# Altium schematic sheet 05_IO.SchDoc
size A4; CheckedBy: Inženjer 2; CompanyName: Byte Lab Grupa d.o.o.; Engineer: Matija Puskar; Organization: Byte Lab Grupa d.o.o.; Address1: Medarska 69/1, 10000 Zagreb, Croatia; DocumentNumber: 1; SheetNumber: 5; SheetTotal: 7; Web: www.byte-lab.com; ProjectName: P1X-0XX
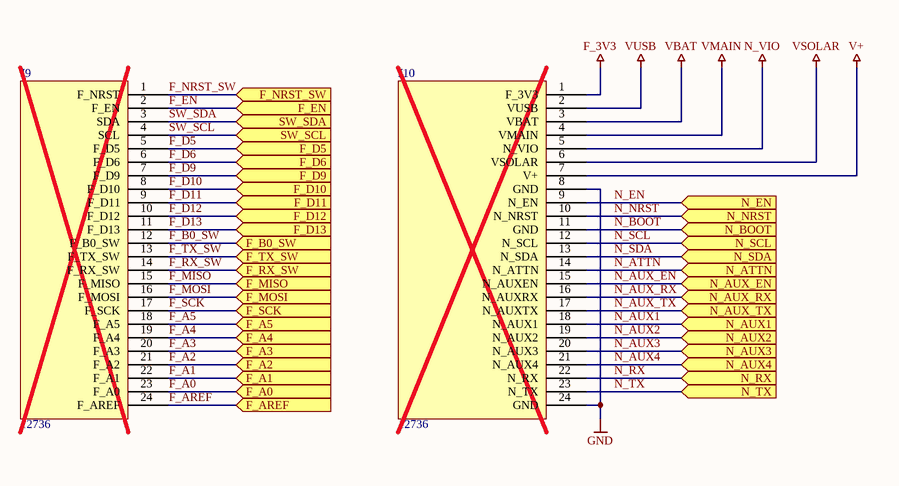
[diagram p0: 05_IO.SchDoc]

## Parts
J9  12736  [CES-124-01-S-S]
J10  12736  [CES-124-01-S-S]

## Ports
F_A0 (in), F_A1 (in), F_A2 (in), F_A3 (in), F_A4 (in), F_A5 (in), F_AREF (in), F_B0_SW (in), F_D5 (in), F_D6 (in), F_D9 (in), F_D10 (in), F_D11 (in), F_D12 (in), F_D13 (in), F_EN (in), F_MISO (in), F_MOSI (in), F_NRST_SW (in), F_RX_SW (in), F_SCK (in), F_TX_SW (in), N_ATTN (in), N_AUX1 (in), N_AUX2 (in), N_AUX3 (in), N_AUX4 (in), N_AUX_EN (in), N_AUX_RX (in), N_AUX_TX (in), N_BOOT (in), N_EN (in), N_NRST (in), N_RX (in), N_SCL (in), N_SDA (in), N_TX (in), SW_SCL (in), SW_SDA (in)

## Nets
F_3V3: J10.1(F_3V3)
GND: J10.8(GND) J10.24(GND)
N_VIO: J10.5(N_VIO)
V+: J10.7(V+)
VBAT: J10.3(VBAT)
VMAIN: J10.4(VMAIN)
VSOLAR: J10.6(VSOLAR)
VUSB: J10.2(VUSB)
F_A0: J9.23(F_A0) ; port F_A0
F_A1: J9.22(F_A1) ; port F_A1
F_A2: J9.21(F_A2) ; port F_A2
F_A3: J9.20(F_A3) ; port F_A3
F_A4: J9.19(F_A4) ; port F_A4
F_A5: J9.18(F_A5) ; port F_A5
F_AREF: J9.24(F_AREF) ; port F_AREF
F_B0_SW: J9.12(F_B0_SW) ; port F_B0_SW
F_D5: J9.5(F_D5) ; port F_D5
F_D6: J9.6(F_D6) ; port F_D6
F_D9: J9.7(F_D9) ; port F_D9
F_D10: J9.8(F_D10) ; port F_D10
F_D11: J9.9(F_D11) ; port F_D11
F_D12: J9.10(F_D12) ; port F_D12
F_D13: J9.11(F_D13) ; port F_D13
F_EN: J9.2(F_EN) ; port F_EN
F_MISO: J9.15(F_MISO) ; port F_MISO
F_MOSI: J9.16(F_MOSI) ; port F_MOSI
F_NRST_SW: J9.1(F_NRST) ; port F_NRST_SW
F_RX_SW: J9.14(F_RX_SW) ; port F_RX_SW
F_SCK: J9.17(F_SCK) ; port F_SCK
F_TX_SW: J9.13(F_TX_SW) ; port F_TX_SW
N_ATTN: J10.14(N_ATTN) ; port N_ATTN
N_AUX1: J10.18(N_AUX1) ; port N_AUX1
N_AUX2: J10.19(N_AUX2) ; port N_AUX2
N_AUX3: J10.20(N_AUX3) ; port N_AUX3
N_AUX4: J10.21(N_AUX4) ; port N_AUX4
N_AUX_EN: J10.15(N_AUXEN) ; port N_AUX_EN
N_AUX_RX: J10.16(N_AUXRX) ; port N_AUX_RX
N_AUX_TX: J10.17(N_AUXTX) ; port N_AUX_TX
N_BOOT: J10.11(GND) ; port N_BOOT
N_EN: J10.9(N_EN) ; port N_EN
N_NRST: J10.10(N_NRST) ; port N_NRST
N_RX: J10.22(N_RX) ; port N_RX
N_SCL: J10.12(N_SCL) ; port N_SCL
N_SDA: J10.13(N_SDA) ; port N_SDA
N_TX: J10.23(N_TX) ; port N_TX
SW_SCL: J9.4(SCL) ; port SW_SCL
SW_SDA: J9.3(SDA) ; port SW_SDA

## Notes on the sheet
- This document is the exclusive property of Byte Lab d.o.o. Company and it should not be distributed or reproduced into any other format without prior permission from Byte Lab d.o.o.
- Project:
- Title:
- Author:
- Company:
- Acceptor:
- Format: A4
- Sheet
- of
- Rev:

## Library data of the parts
J9 = SIDECON: 24x1 0.1" pitch half height female header; Manufacturer: 4UCON; BL Part Number: 2010-425; Drawn_By: Blues Wireless; Supplier 1: *; Supplier Part Number 1: *; Manufacturer Part Number: 12736
J10 = SIDECON_N: 24x1 0.1" pitch half height female header; Manufacturer: 4UCON; BL Part Number: 2010-425; Drawn_By: Blues Wireless; Supplier 1: *; Supplier Part Number 1: *; Manufacturer Part Number: 12736